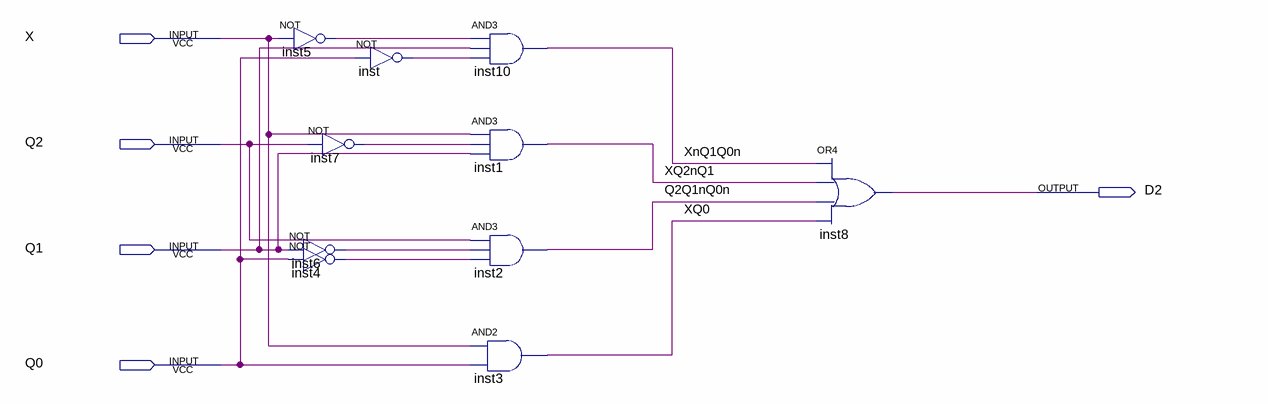
[diagram p0: schematic sheet]
// Quartus schematic D2.bdf as structural Verilog: 10 symbols, 5 pins
module D2 (
  input  X,
  input  Q2,
  input  Q1,
  input  Q0,
  output D2
);

  wire inst4_out, inst5_out, inst6_out, inst7_out, inst_out, Q2Q1nQ0n, XnQ1Q0n, XQ0, XQ2nQ1;

  not inst5 (inst5_out, X);
  not inst7 (inst7_out, Q2);
  not inst6 (inst6_out, Q1);
  not inst4 (inst4_out, Q0);
  not inst (inst_out, Q0);
  and inst10 (XnQ1Q0n, inst5_out, Q1, inst_out);
  and inst1 (XQ2nQ1, X, inst7_out, Q1);
  and inst2 (Q2Q1nQ0n, Q2, inst6_out, inst4_out);
  and inst3 (XQ0, X, Q0);
  or inst8 (D2, XnQ1Q0n, XQ2nQ1, Q2Q1nQ0n, XQ0);
endmodule
